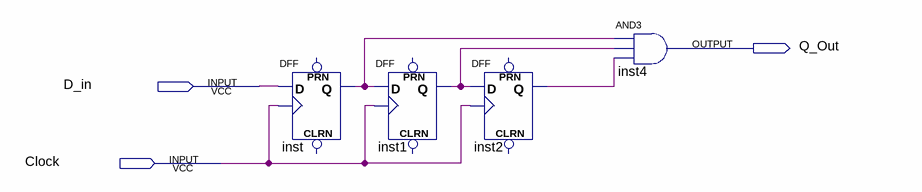
[diagram p0: schematic sheet]
// Quartus schematic Debouncer.bdf as structural Verilog: 4 symbols, 3 pins
module Debouncer (
  input  D_in,
  input  Clock,
  output Q_Out
);

  wire inst1_q, inst2_q, inst_q;

  DFF inst (.CLK(Clock), .D(D_in), .Q(inst_q));  // open: CLRN, PRN
  DFF inst1 (.CLK(Clock), .D(inst_q), .Q(inst1_q));  // open: CLRN, PRN
  DFF inst2 (.CLK(Clock), .D(inst1_q), .Q(inst2_q));  // open: CLRN, PRN
  and inst4 (Q_Out, inst_q, inst1_q, inst2_q);
endmodule
